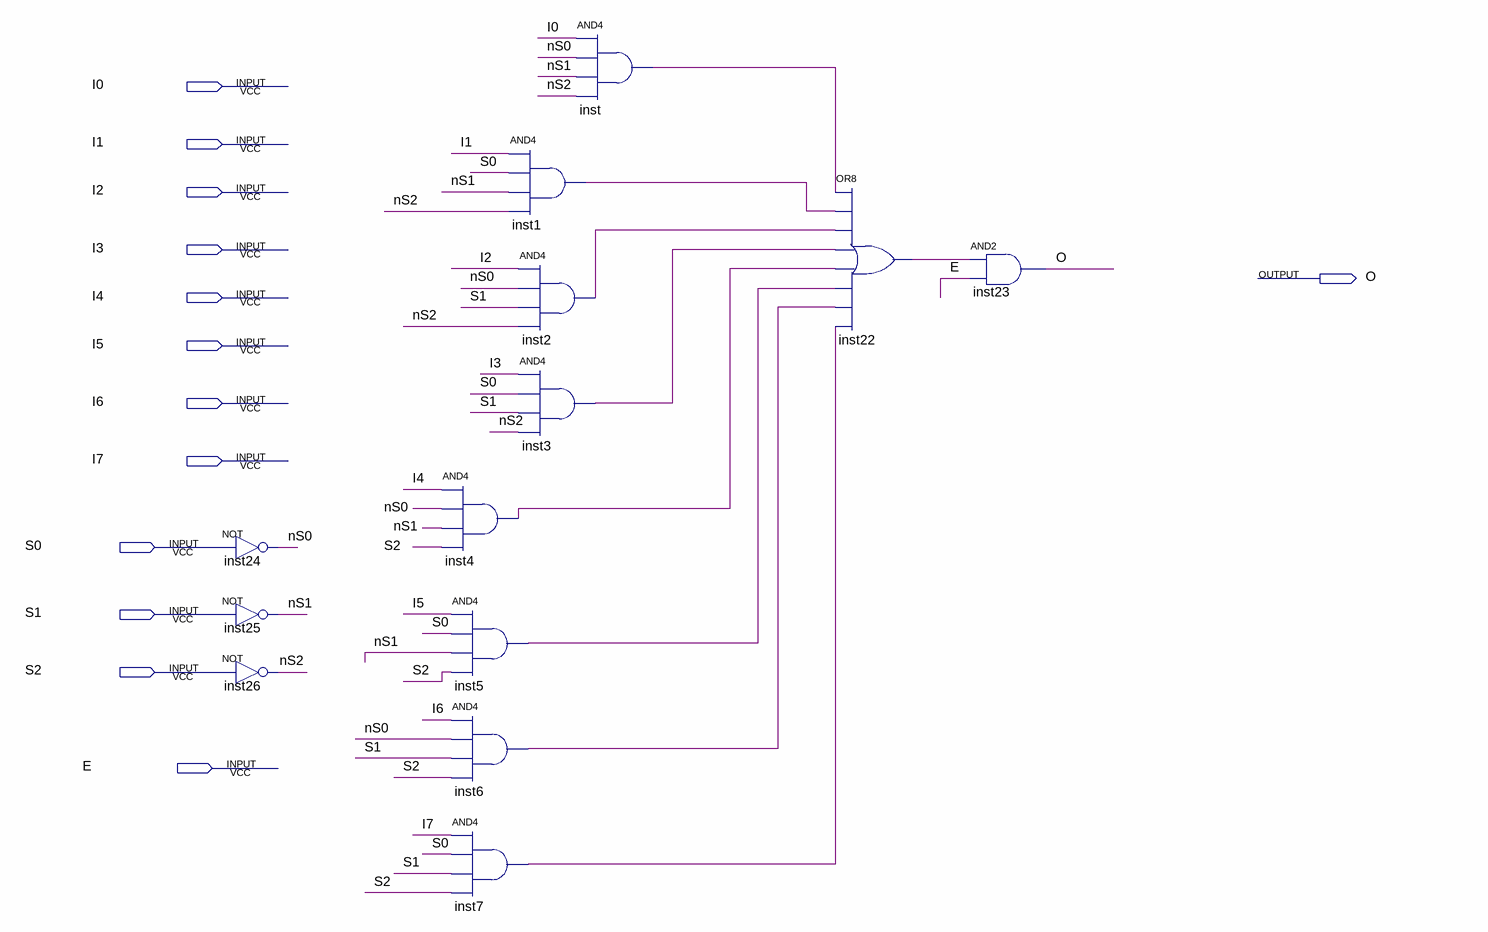
[diagram p0: schematic sheet]
// Quartus schematic MUX8_1.bdf as structural Verilog: 13 symbols, 13 pins
module MUX8_1 (
  input  I0,
  input  I1,
  input  I2,
  input  I3,
  input  I4,
  input  I5,
  input  I6,
  input  I7,
  input  S0,
  input  S1,
  input  S2,
  input  E,
  output O
);

  wire inst1_out, inst2_out, inst3_out, inst4_out, inst5_out, inst6_out, inst7_out, inst22_out, inst_out,
       nS0, nS1, nS2;

  not inst24 (nS0, S0);
  not inst25 (nS1, S1);
  not inst26 (nS2, S2);
  and inst4 (inst4_out, I4, nS0, nS1, S2);
  and inst5 (inst5_out, I5, S0, nS1, S2);
  and inst6 (inst6_out, I6, nS0, S1, S2);
  and inst7 (inst7_out, I7, S0, S1, S2);
  and inst1 (inst1_out, I1, S0, nS1, nS2);
  and inst2 (inst2_out, I2, nS0, S1, nS2);
  and inst3 (inst3_out, I3, S0, S1, nS2);
  and inst (inst_out, I0, nS0, nS1, nS2);
  or inst22 (inst22_out, inst_out, inst1_out, inst2_out, inst3_out, inst4_out, inst5_out, inst6_out, inst7_out);
  and inst23 (O, inst22_out, E);
endmodule
